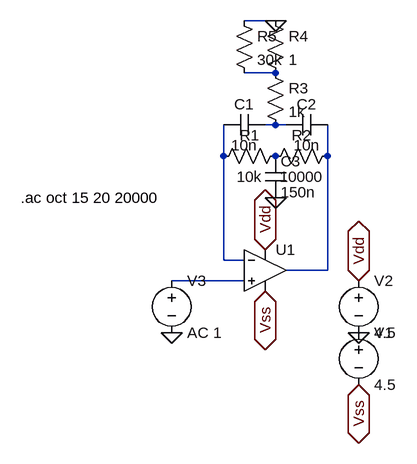
[diagram p0: schematic Wah.asc]
Wah.asc, the LTspice schematic file:
Version 4
SHEET 1 1208 680
WIRE 144 -256 96 -256
WIRE 144 -176 96 -176
WIRE 144 -96 128 -96
WIRE 160 -96 144 -96
WIRE 64 -48 64 -96
WIRE 224 -48 224 -96
WIRE 64 112 64 -48
WIRE 96 112 64 112
WIRE 224 128 224 -48
WIRE 224 128 160 128
WIRE 96 144 -16 144
FLAG 272 224 0
FLAG -16 224 0
FLAG 272 144 Vdd
IOPIN 272 144 BiDir
FLAG 128 96 Vdd
IOPIN 128 96 BiDir
FLAG 128 160 Vss
IOPIN 128 160 BiDir
FLAG 272 304 Vss
IOPIN 272 304 BiDir
FLAG 144 -256 0
FLAG 144 16 0
SYMBOL Opamps\\UniversalOpamp2 128 128 R0
SYMATTR InstName U1
SYMBOL voltage 272 208 R0
WINDOW 123 0 0 Left 0
WINDOW 39 0 0 Left 0
SYMATTR InstName V1
SYMATTR Value 4.5
SYMBOL voltage 272 128 R0
WINDOW 123 0 0 Left 0
WINDOW 39 0 0 Left 0
SYMATTR InstName V2
SYMATTR Value 4.5
SYMBOL voltage -16 128 R0
WINDOW 123 0 0 Left 0
WINDOW 39 0 0 Left 0
SYMATTR InstName V3
SYMATTR Value AC 1
SYMBOL cap 128 -112 R90
WINDOW 0 0 32 VBottom 2
WINDOW 3 32 32 VTop 2
SYMATTR InstName C1
SYMATTR Value 10n
SYMBOL res 160 -64 R90
WINDOW 0 0 56 VBottom 2
WINDOW 3 32 56 VTop 2
SYMATTR InstName R1
SYMATTR Value 10k
SYMBOL res 240 -64 R90
WINDOW 0 0 56 VBottom 2
WINDOW 3 32 56 VTop 2
SYMATTR InstName R2
SYMATTR Value 10000
SYMBOL cap 224 -112 R90
WINDOW 0 0 32 VBottom 2
WINDOW 3 32 32 VTop 2
SYMATTR InstName C2
SYMATTR Value 10n
SYMBOL res 128 -192 R0
SYMATTR InstName R3
SYMATTR Value 1k
SYMBOL cap 128 -48 R0
SYMATTR InstName C3
SYMATTR Value 150n
SYMBOL res 128 -272 R0
SYMATTR InstName R4
SYMATTR Value 1
SYMBOL res 80 -272 R0
SYMATTR InstName R5
SYMATTR Value 30k
TEXT -248 16 Left 2 !.ac oct 15 20 20000

The netlist it stands for:
* Wah.asc
XU1 N005 N003 Vdd Vss N004 level.2 Avol=1Meg GBW=10Meg Slew=10Meg ilimit=25m rail=0 Vos=0 phimargin=45 en=0 enk=0 in=0 ink=0 Rin=500Meg  ; pins IN+ IN- V+ V- OUT
V1 0 Vss 4.5
V2 Vdd 0 4.5
V3 N005 0 AC 1
C1 N002 N003 10n
R1 P001 N003 10k
R2 N004 P001 10000
C2 N004 N002 10n
R3 N001 N002 1k
C3 P001 0 150n
R4 0 N001 1
R5 0 N001 30k
.ac oct 15 20 20000
.lib UniversalOpamps2.sub
.backanno
.end